# Altium schematic sheet MPU Power.SchDoc
size A4
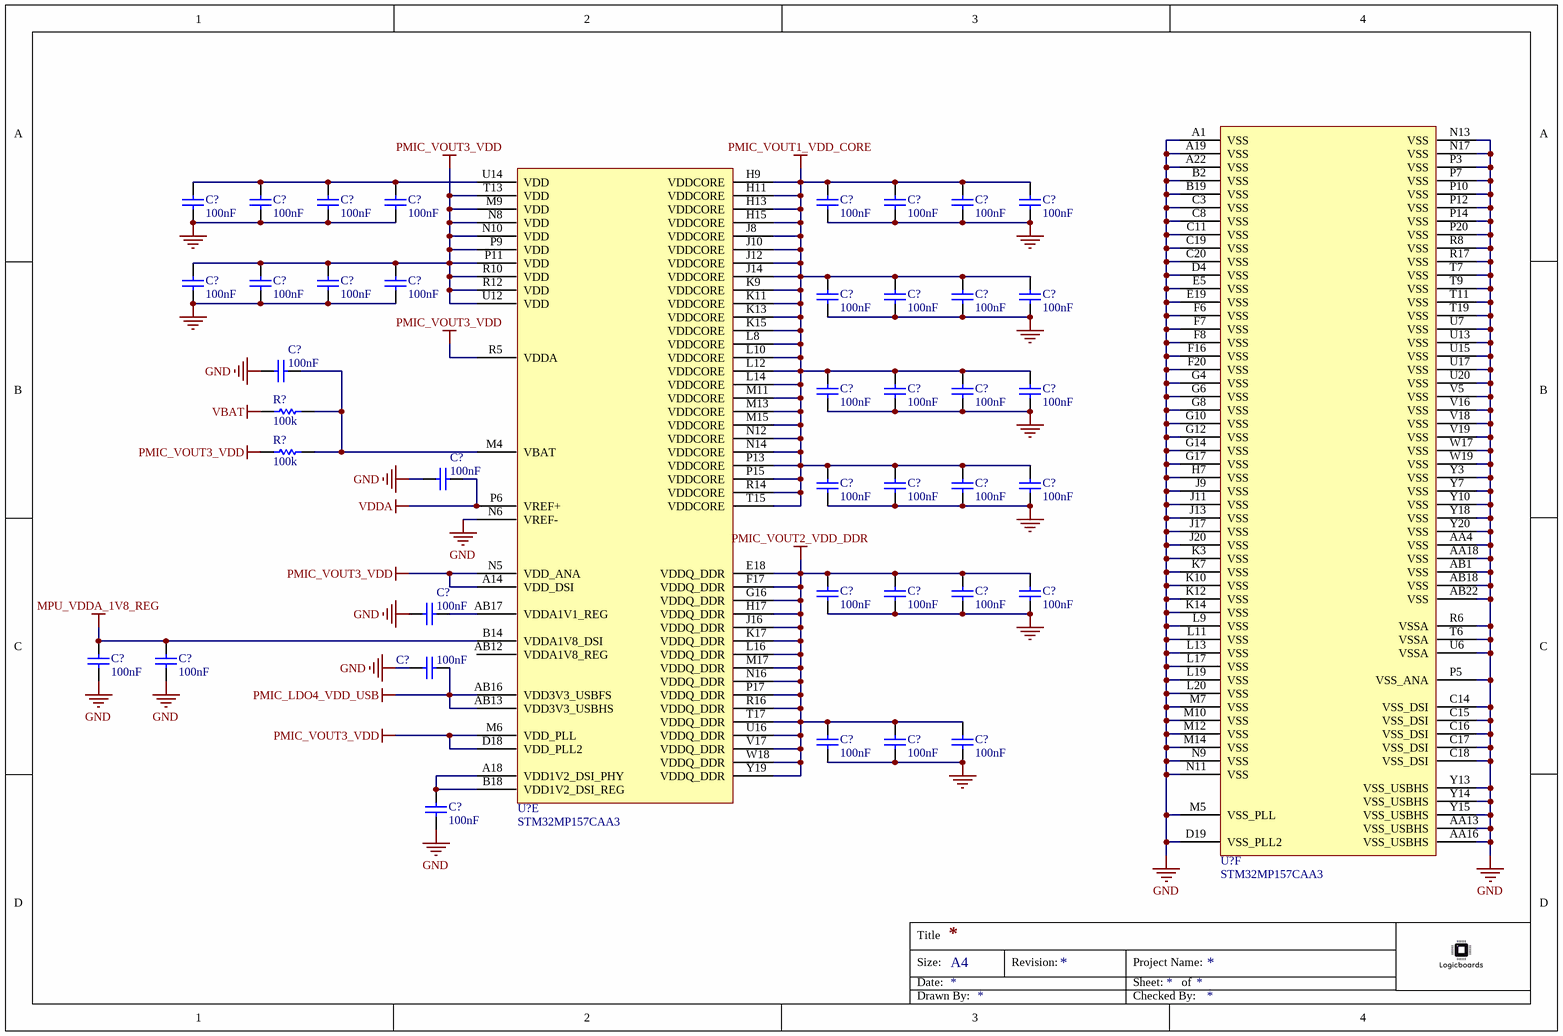
[diagram p0: MPU Power.SchDoc]

## Parts
(Parts that share a designator on the sheet are numbered #1, #2 ... from top to bottom, then left to right.)
C?#1  100nF
C?#2  100nF
C?#3  100nF
C?#4  100nF
C?#5  100nF
C?#6  100nF
C?#7  100nF
C?#8  100nF
C?#9  100nF
C?#10  100nF
C?#11  100nF
C?#12  100nF
C?#13  100nF
C?#14  100nF
C?#15  100nF
C?#16  100nF
C?#17  100nF
C?#18  100nF
C?#19  100nF
C?#20  100nF
C?#21  100nF
C?#22  100nF
C?#23  100nF
C?#24  100nF
C?#25  100nF
C?#26  100nF
C?#27  100nF
C?#28  100nF
C?#29  100nF
C?#30  100nF
C?#31  100nF
C?#32  100nF
C?#33  100nF
C?#34  100nF
C?#35  100nF
C?#36  100nF
C?#37  100nF
C?#38  100nF
R?#1  100k
R?#2  100k
U?#1  STM32MP157CAA3  (part E of 6)
U?#2  STM32MP157CAA3  (part F of 6)

## Nets
GND: C?#1.2 C?#2.2 C?#3.2 C?#4.2 C?#5.2 C?#6.2 C?#7.2 C?#8.2 C?#9.2 C?#10.2 C?#11.2 C?#12.2 C?#13.2 C?#14.2 C?#15.2 C?#16.2 C?#17.1 C?#18.2 C?#19.2 C?#20.2 C?#21.2 C?#22.1 C?#23.2 C?#24.2 C?#25.2 C?#26.2 C?#27.2 C?#28.2 C?#29.2 C?#30.2 C?#31.1 C?#32.2 C?#33.2 C?#34.1 C?#35.2 C?#36.2 C?#37.2 C?#38.2 U?#1.N6(VREF-) U?#2.A1(VSS) U?#2.A19(VSS) U?#2.A22(VSS) U?#2.AA4(VSS) U?#2.AA13(VSS_USBHS) U?#2.AA16(VSS_USBHS) U?#2.AA18(VSS) U?#2.AB1(VSS) U?#2.AB18(VSS) U?#2.AB22(VSS) U?#2.B2(VSS) U?#2.B19(VSS) U?#2.C3(VSS) U?#2.C8(VSS) U?#2.C11(VSS) U?#2.C14(VSS_DSI) U?#2.C15(VSS_DSI) U?#2.C16(VSS_DSI) U?#2.C17(VSS_DSI) U?#2.C18(VSS_DSI) U?#2.C19(VSS) U?#2.C20(VSS) U?#2.D4(VSS) U?#2.D19(VSS_PLL2) U?#2.E5(VSS) U?#2.E19(VSS) U?#2.F6(VSS) U?#2.F7(VSS) U?#2.F8(VSS) U?#2.F16(VSS) U?#2.F20(VSS) U?#2.G4(VSS) U?#2.G6(VSS) U?#2.G8(VSS) U?#2.G10(VSS) U?#2.G12(VSS) U?#2.G14(VSS) U?#2.G17(VSS) U?#2.H7(VSS) U?#2.J9(VSS) U?#2.J11(VSS) U?#2.J13(VSS) U?#2.J17(VSS) U?#2.J20(VSS) U?#2.K3(VSS) U?#2.K7(VSS) U?#2.K10(VSS) U?#2.K12(VSS) U?#2.K14(VSS) U?#2.L9(VSS) U?#2.L11(VSS) U?#2.L13(VSS) U?#2.L17(VSS) U?#2.L19(VSS) U?#2.L20(VSS) U?#2.M5(VSS_PLL) U?#2.M7(VSS) U?#2.M10(VSS) U?#2.M12(VSS) U?#2.M14(VSS) U?#2.N9(VSS) U?#2.N11(VSS) U?#2.N13(VSS) U?#2.N17(VSS) U?#2.P3(VSS) U?#2.P5(VSS_ANA) U?#2.P7(VSS) U?#2.P10(VSS) U?#2.P12(VSS) U?#2.P14(VSS) U?#2.P20(VSS) U?#2.R6(VSSA) U?#2.R8(VSS) U?#2.R17(VSS) U?#2.T6(VSSA) U?#2.T7(VSS) U?#2.T9(VSS) U?#2.T11(VSS) U?#2.T19(VSS) U?#2.U6(VSSA) U?#2.U7(VSS) U?#2.U13(VSS) U?#2.U15(VSS) U?#2.U17(VSS) U?#2.U20(VSS) U?#2.V5(VSS) U?#2.V16(VSS) U?#2.V18(VSS) U?#2.V19(VSS) U?#2.W17(VSS) U?#2.W19(VSS) U?#2.Y3(VSS) U?#2.Y7(VSS) U?#2.Y10(VSS) U?#2.Y13(VSS_USBHS) U?#2.Y14(VSS_USBHS) U?#2.Y15(VSS_USBHS) U?#2.Y18(VSS) U?#2.Y20(VSS)
MPU_VDDA_1V8_REG: C?#32.1 C?#33.1 U?#1.B14(VDDA1V8_DSI)
PMIC_LDO4_VDD_USB: C?#34.2 U?#1.AB13(VDD3V3_USBHS) U?#1.AB16(VDD3V3_USBFS)
PMIC_VOUT1_VDD_CORE: C?#5.1 C?#6.1 C?#7.1 C?#8.1 C?#13.1 C?#14.1 C?#15.1 C?#16.1 C?#18.1 C?#19.1 C?#20.1 C?#21.1 C?#23.1 C?#24.1 C?#25.1 C?#26.1 U?#1.H9(VDDCORE) U?#1.H11(VDDCORE) U?#1.H13(VDDCORE) U?#1.H15(VDDCORE) U?#1.J8(VDDCORE) U?#1.J10(VDDCORE) U?#1.J12(VDDCORE) U?#1.J14(VDDCORE) U?#1.K9(VDDCORE) U?#1.K11(VDDCORE) U?#1.K13(VDDCORE) U?#1.K15(VDDCORE) U?#1.L8(VDDCORE) U?#1.L10(VDDCORE) U?#1.L12(VDDCORE) U?#1.L14(VDDCORE) U?#1.M11(VDDCORE) U?#1.M13(VDDCORE) U?#1.M15(VDDCORE) U?#1.N12(VDDCORE) U?#1.N14(VDDCORE) U?#1.P13(VDDCORE) U?#1.P15(VDDCORE) U?#1.R14(VDDCORE) U?#1.T15(VDDCORE)
PMIC_VOUT2_VDD_DDR: C?#27.1 C?#28.1 C?#29.1 C?#30.1 C?#35.1 C?#36.1 C?#37.1 U?#1.E18(VDDQ_DDR) U?#1.F17(VDDQ_DDR) U?#1.G16(VDDQ_DDR) U?#1.H17(VDDQ_DDR) U?#1.J16(VDDQ_DDR) U?#1.K17(VDDQ_DDR) U?#1.L16(VDDQ_DDR) U?#1.M17(VDDQ_DDR) U?#1.N16(VDDQ_DDR) U?#1.P17(VDDQ_DDR) U?#1.R16(VDDQ_DDR) U?#1.T17(VDDQ_DDR) U?#1.U16(VDDQ_DDR) U?#1.V17(VDDQ_DDR) U?#1.W18(VDDQ_DDR) U?#1.Y19(VDDQ_DDR)
PMIC_VOUT3_VDD: C?#9.1 C?#10.1 C?#11.1 C?#12.1 R?#2.1 U?#1.A14(VDD_DSI) U?#1.D18(VDD_PLL2) U?#1.M6(VDD_PLL) U?#1.M9(VDD) U?#1.N5(VDD_ANA) U?#1.N8(VDD) U?#1.N10(VDD) U?#1.P9(VDD) U?#1.P11(VDD) U?#1.R5(VDDA) U?#1.R10(VDD) U?#1.R12(VDD) U?#1.T13(VDD) U?#1.U12(VDD)
VBAT: R?#1.1
VDDA: C?#22.2 U?#1.P6(VREF+)
NetC?#1_1: C?#1.1 C?#2.1 C?#3.1 C?#4.1 U?#1.U14(VDD)
NetC?#17_2: C?#17.2 R?#1.2 R?#2.2 U?#1.M4(VBAT)
NetC?#31_2: C?#31.2 U?#1.AB17(VDDA1V1_REG)
NetC?#38_1: C?#38.1 U?#1.A18(VDD1V2_DSI_PHY) U?#1.B18(VDD1V2_DSI_REG)

Not connected (* = marked no-connect by the designer): U?#1 AB12(VDDA1V8_REG)

## Notes on the sheet
- Title
- Size:
- Date:
- A4
- Revision:
- Sheet:
- Project Name:
- of
- Drawn By:
- Checked By:

## Library data of the parts
C?#1-C?#38 = CAP_SMD: Capacitor MLCC; Tolerance: 10%; Dielectric: X5R; Voltage Rating: 6.3V; Supplier 1: Mouser; Manufacturer 1: *; Manufacturer Part Number 1: *; RoHS: Yes; Mount: Surface Mount; Package: *; Capacitance: *; Length: *; Lead Free: Lead Free; Supplier Part Number 1: *; Supplier 2: Digikey; Supplier Part Number 2: *; Value: 100nF
R?#1 R?#2 = RES_SMD: General Purpose Chip Resistor Thick Film; Supplier 1: Mouser; RoHS: Yes; Category: Resistors; RoHS Compliant: Yes; Resistance: *; Supplier 2: Digikey; Supplier Part Number 2: *; Package: *; Value: 100k
U?#1 U?#2 = STM32MP157CAA3: IC MPU with Arm Dual Cortex-A7 650 MHz, Arm Cortex-M4; Manufacturer 1: STMicroelectronics; Supplier 1: Mouser; RoHS: Yes; Category: Microprocessors; Supplier Part Number 1: 511-STM32MP157CAA3; Supplier 2: Digi-Key; Supplier Part Number 2: STM32MP157CAA3-ND; Manufacturer Part Number 1: STM32MP157CAA3; Datasheet: https://www.st.com/resource/en/datasheet/stm32mp157c.pdf